# Altium schematic sheet GS_02_Core.SchDoc: Title
size A3; Date: Date; CompanyName: Integrated Micro-Electronics Bulgaria; Organization: Design & Development Department; Address1: Drawing Type; Address2: Address 1; Address3: Address 2; Address4: Address 3; DocumentNumber: 730xxx; Revision: 01; SheetNumber: 1; SheetTotal: 1; PageSetup: Record=PageOptions|CenterHorizontal=True|CenterVertical=True|PrintScale=0.70|XCorrection=1.00|YCorrection=1.00|PrintKind=2|BorderSize=5000000|LeftOffset=0|BottomOffset=0|Orientation=2|PaperLength=1000|PaperWidth=1000|Scale=100|PaperSource=7|PrintQuality=-4|MediaType=1|DitherType=10|PaperKind=A4|PrintScaleMode=1; SheetSize: A3; Time: Time; ModifiedDate: Mod. Date
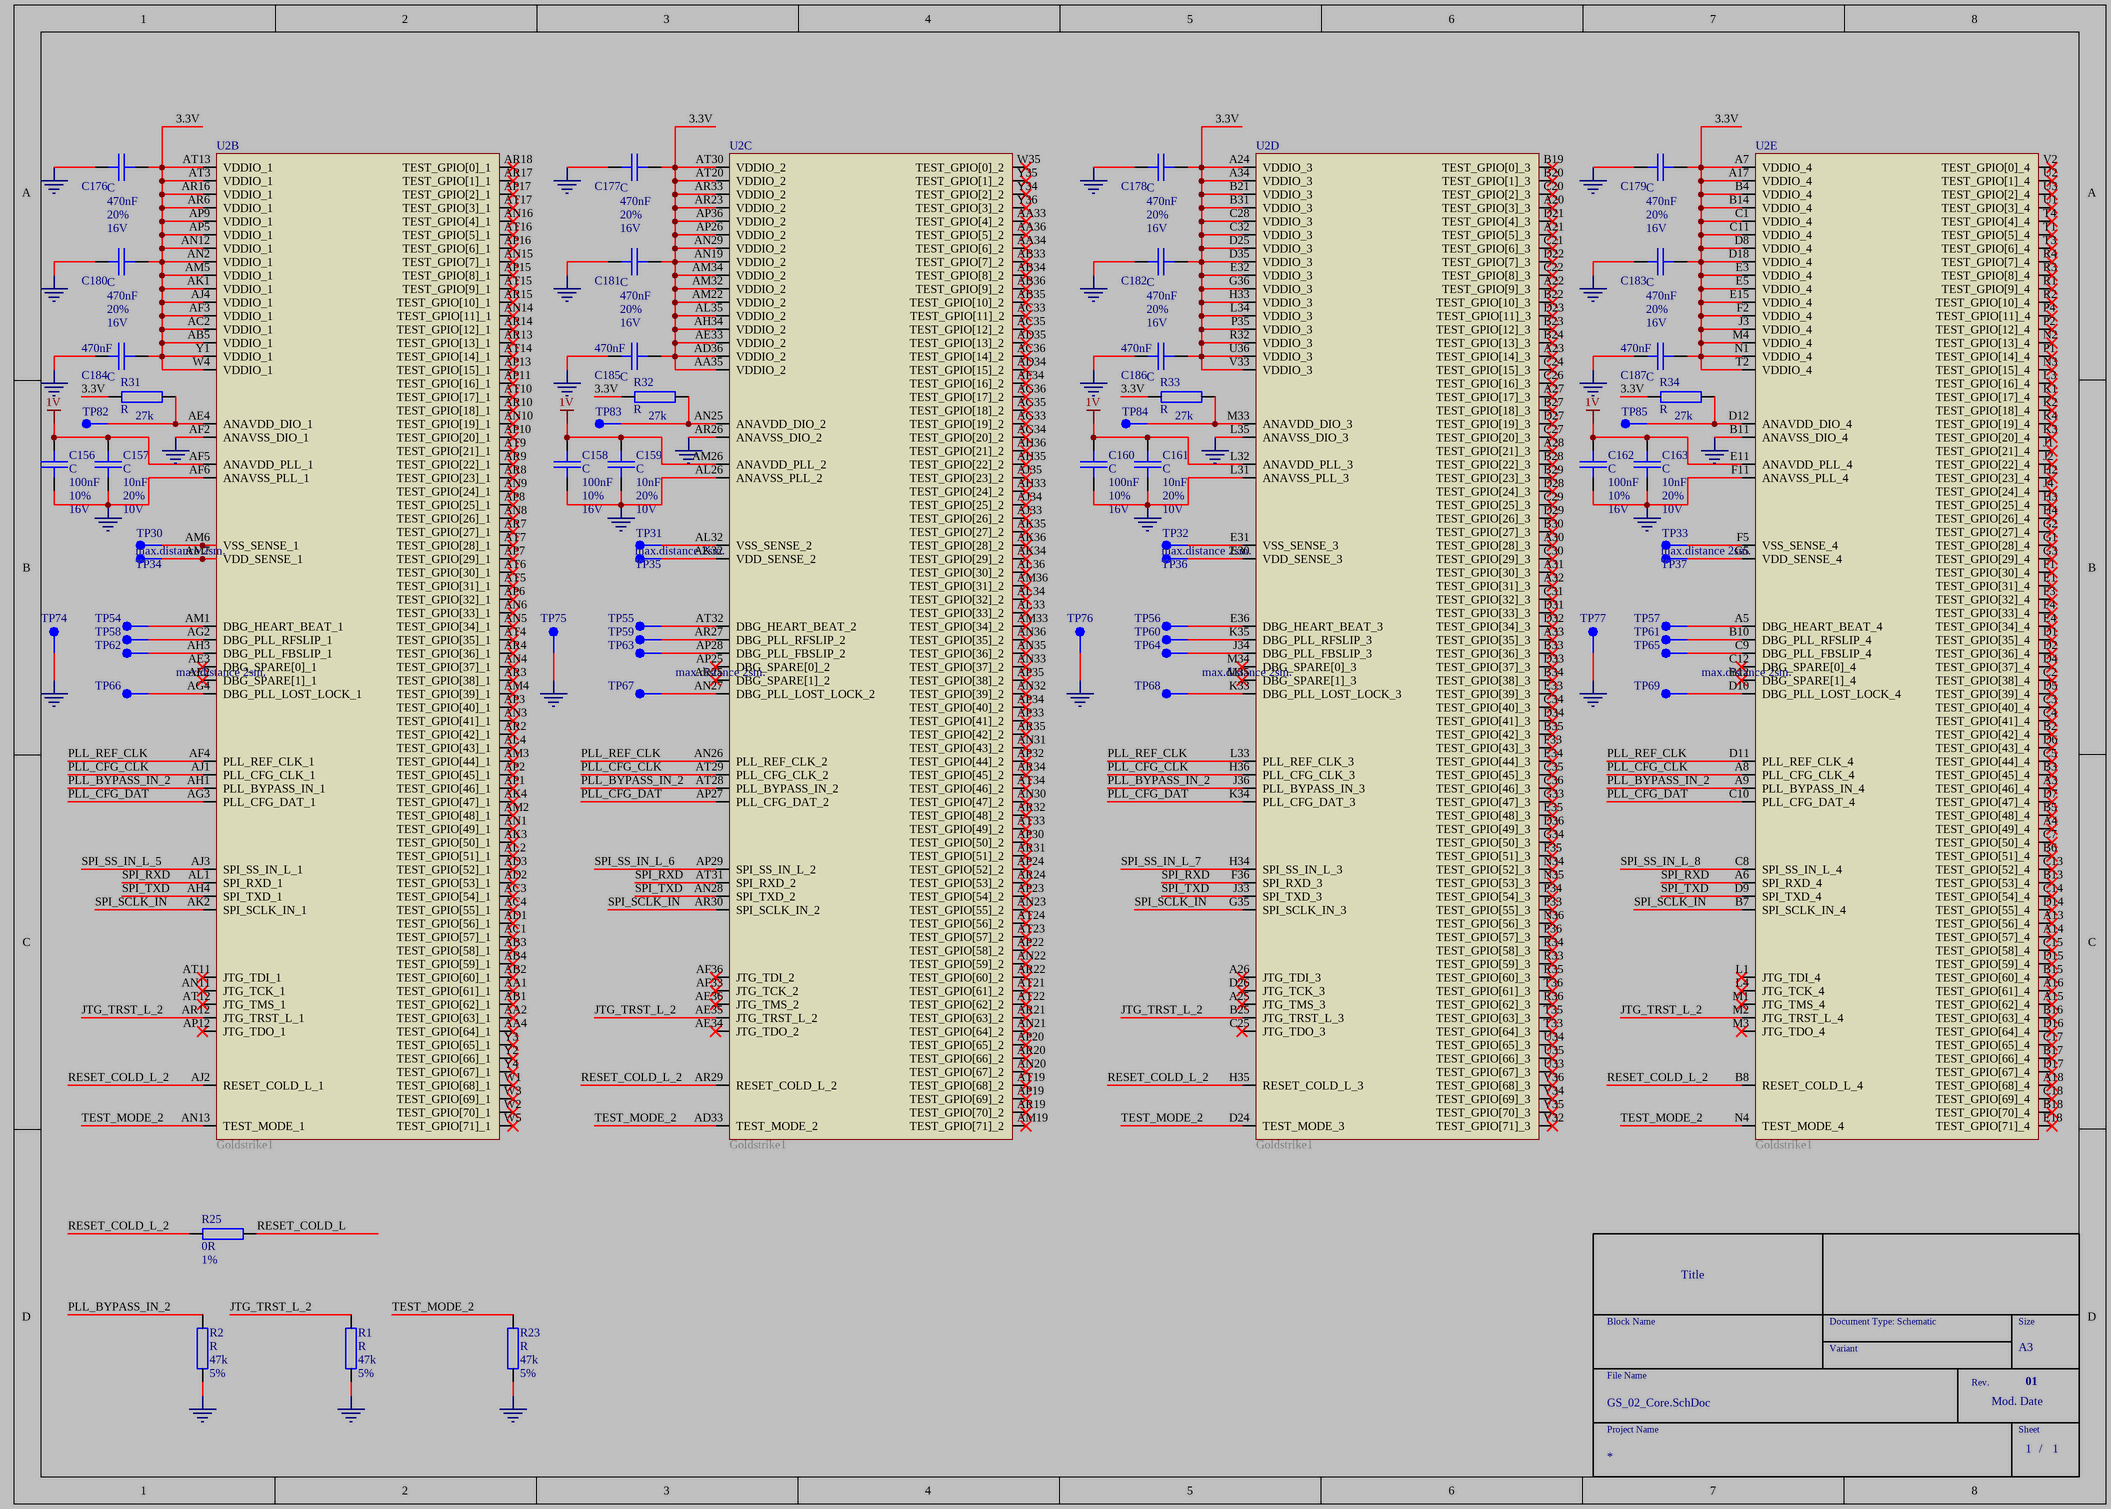
[diagram p0: GS_02_Core.SchDoc]

## Parts
C156  C  DB_VALUE: 100nF  DB_TOLERANCE: 10%  DB_VOLTAGE: 16V  [SMD_0603_CAPC1608X95N]
C157  C  DB_VALUE: 10nF  DB_TOLERANCE: 20%  DB_VOLTAGE: 10V  [SMD_0603_CAPC1608X95N]
C158  C  DB_VALUE: 100nF  DB_TOLERANCE: 10%  DB_VOLTAGE: 16V  [SMD_0603_CAPC1608X95N]
C159  C  DB_VALUE: 10nF  DB_TOLERANCE: 20%  DB_VOLTAGE: 10V  [SMD_0603_CAPC1608X95N]
C160  C  DB_VALUE: 100nF  DB_TOLERANCE: 10%  DB_VOLTAGE: 16V  [SMD_0603_CAPC1608X95N]
C161  C  DB_VALUE: 10nF  DB_TOLERANCE: 20%  DB_VOLTAGE: 10V  [SMD_0603_CAPC1608X95N]
C162  C  DB_VALUE: 100nF  DB_TOLERANCE: 10%  DB_VOLTAGE: 16V  [SMD_0603_CAPC1608X95N]
C163  C  DB_VALUE: 10nF  DB_TOLERANCE: 20%  DB_VOLTAGE: 10V  [SMD_0603_CAPC1608X95N]
C176  C  DB_VALUE: 470nF  DB_TOLERANCE: 20%  DB_VOLTAGE: 16V  [SMD_0603_CAPC1608X95N]
C177  C  DB_VALUE: 470nF  DB_TOLERANCE: 20%  DB_VOLTAGE: 16V  [SMD_0603_CAPC1608X95N]
C178  C  DB_VALUE: 470nF  DB_TOLERANCE: 20%  DB_VOLTAGE: 16V  [SMD_0603_CAPC1608X95N]
C179  C  DB_VALUE: 470nF  DB_TOLERANCE: 20%  DB_VOLTAGE: 16V  [SMD_0603_CAPC1608X95N]
C180  C  DB_VALUE: 470nF  DB_TOLERANCE: 20%  DB_VOLTAGE: 16V  [SMD_0603_CAPC1608X95N]
C181  C  DB_VALUE: 470nF  DB_TOLERANCE: 20%  DB_VOLTAGE: 16V  [SMD_0603_CAPC1608X95N]
C182  C  DB_VALUE: 470nF  DB_TOLERANCE: 20%  DB_VOLTAGE: 16V  [SMD_0603_CAPC1608X95N]
C183  C  DB_VALUE: 470nF  DB_TOLERANCE: 20%  DB_VOLTAGE: 16V  [SMD_0603_CAPC1608X95N]
C184  C  DB_VALUE: 470nF  [SMD_0603_CAPC1608X95N]
C185  C  DB_VALUE: 470nF  [SMD_0603_CAPC1608X95N]
C186  C  DB_VALUE: 470nF  [SMD_0603_CAPC1608X95N]
C187  C  DB_VALUE: 470nF  [SMD_0603_CAPC1608X95N]
R1  R  DB_VALUE: 47k  DB_TOLERANCE: 5%  [SMD_0603_RESC1608X55N]
R2  R  DB_VALUE: 47k  DB_TOLERANCE: 5%  [SMD_0603_RESC1608X55N]
R23  R  DB_VALUE: 47k  DB_TOLERANCE: 5%  [SMD_0603_RESC1608X55N]
R25  DB_VALUE: 0R  DB_TOLERANCE: 1%  [SMD_0603_RESC1608X55N]  (hidden comment: R)
R31  R  DB_VALUE: 27k  [SMD_0603_RESC1608X55N]
R32  R  DB_VALUE: 27k  [SMD_0603_RESC1608X55N]
R33  R  DB_VALUE: 27k  [SMD_0603_RESC1608X55N]
R34  R  DB_VALUE: 27k  [SMD_0603_RESC1608X55N]
TP30  TEST_POINT_1  [SMD_TP_100-254]  (value not drawn)
TP31  TEST_POINT_1  [SMD_TP_100-254]  (value not drawn)
TP32  TEST_POINT_1  [SMD_TP_100-254]  (value not drawn)
TP33  TEST_POINT_1  [SMD_TP_100-254]  (value not drawn)
TP34  TEST_POINT_1  [SMD_TP_100-254]  (value not drawn)
TP35  TEST_POINT_1  [SMD_TP_100-254]  (value not drawn)
TP36  TEST_POINT_1  [SMD_TP_100-254]  (value not drawn)
TP37  TEST_POINT_1  [SMD_TP_100-254]  (value not drawn)
TP54  TEST_POINT_1  [SMD_TP_100-254]  (value not drawn)
TP55  TEST_POINT_1  [SMD_TP_100-254]  (value not drawn)
TP56  TEST_POINT_1  [SMD_TP_100-254]  (value not drawn)
TP57  TEST_POINT_1  [SMD_TP_100-254]  (value not drawn)
TP58  TEST_POINT_1  [SMD_TP_100-254]  (value not drawn)
TP59  TEST_POINT_1  [SMD_TP_100-254]  (value not drawn)
TP60  TEST_POINT_1  [SMD_TP_100-254]  (value not drawn)
TP61  TEST_POINT_1  [SMD_TP_100-254]  (value not drawn)
TP62  TEST_POINT_1  [SMD_TP_100-254]  (value not drawn)
TP63  TEST_POINT_1  [SMD_TP_100-254]  (value not drawn)
TP64  TEST_POINT_1  [SMD_TP_100-254]  (value not drawn)
TP65  TEST_POINT_1  [SMD_TP_100-254]  (value not drawn)
TP66  TEST_POINT_1  [SMD_TP_100-254]  (value not drawn)
TP67  TEST_POINT_1  [SMD_TP_100-254]  (value not drawn)
TP68  TEST_POINT_1  [SMD_TP_100-254]  (value not drawn)
TP69  TEST_POINT_1  [SMD_TP_100-254]  (value not drawn)
TP74  TEST_POINT_1  [SMD_TP_100-254]  (value not drawn)
TP75  TEST_POINT_1  [SMD_TP_100-254]  (value not drawn)
TP76  TEST_POINT_1  [SMD_TP_100-254]  (value not drawn)
TP77  TEST_POINT_1  [SMD_TP_100-254]  (value not drawn)
TP82  TEST_POINT_1  [SMD_TP_100-254]  (value not drawn)
TP83  TEST_POINT_1  [SMD_TP_100-254]  (value not drawn)
TP84  TEST_POINT_1  [SMD_TP_100-254]  (value not drawn)
TP85  TEST_POINT_1  [SMD_TP_100-254]  (value not drawn)
U2  Goldstrike1  (parts B,C,D,E of 5)

## Nets
1V: C156.1 C157.1 C158.1 C159.1 C160.1 C161.1 C162.1 C163.1 U2.AF5(ANAVDD_PLL_1) U2.AM26(ANAVDD_PLL_2) U2.E11(ANAVDD_PLL_4) U2.L32(ANAVDD_PLL_3)
GND: C156.2 C157.2 C158.2 C159.2 C160.2 C161.2 C162.2 C163.2 C176.1 C177.1 C178.1 C179.1 C180.1 C181.1 C182.1 C183.1 C184.1 C185.1 C186.1 C187.1 R1.2 R2.2 R23.2 TP74.1 TP75.1 TP76.1 TP77.1 U2.AF2(ANAVSS_DIO_1) U2.AF6(ANAVSS_PLL_1) U2.AL26(ANAVSS_PLL_2) U2.AR26(ANAVSS_DIO_2) U2.B11(ANAVSS_DIO_4) U2.F11(ANAVSS_PLL_4) U2.L31(ANAVSS_PLL_3) U2.L35(ANAVSS_DIO_3)
3.3V: C176.2 C177.2 C178.2 C179.2 C180.2 C181.2 C182.2 C183.2 C184.2 C185.2 C186.2 C187.2 R31.1 R32.1 R33.1 R34.1 U2.A7(VDDIO_4) U2.A17(VDDIO_4) U2.A24(VDDIO_3) U2.A34(VDDIO_3) U2.AA35(VDDIO_2) U2.AB5(VDDIO_1) U2.AC2(VDDIO_1) U2.AD36(VDDIO_2) U2.AE33(VDDIO_2) U2.AF3(VDDIO_1) U2.AH34(VDDIO_2) U2.AJ4(VDDIO_1) U2.AK1(VDDIO_1) U2.AL35(VDDIO_2) U2.AM5(VDDIO_1) U2.AM22(VDDIO_2) U2.AM32(VDDIO_2) U2.AM34(VDDIO_2) U2.AN2(VDDIO_1) U2.AN12(VDDIO_1) U2.AN19(VDDIO_2) U2.AN29(VDDIO_2) U2.AP5(VDDIO_1) U2.AP9(VDDIO_1) U2.AP26(VDDIO_2) U2.AP36(VDDIO_2) U2.AR6(VDDIO_1) U2.AR16(VDDIO_1) U2.AR23(VDDIO_2) U2.AR33(VDDIO_2) U2.AT3(VDDIO_1) U2.AT13(VDDIO_1) U2.AT20(VDDIO_2) U2.AT30(VDDIO_2) U2.B4(VDDIO_4) U2.B14(VDDIO_4) U2.B21(VDDIO_3) U2.B31(VDDIO_3) U2.C1(VDDIO_4) U2.C11(VDDIO_4) U2.C28(VDDIO_3) U2.C32(VDDIO_3) U2.D8(VDDIO_4) U2.D18(VDDIO_4) U2.D25(VDDIO_3) U2.D35(VDDIO_3) U2.E3(VDDIO_4) U2.E5(VDDIO_4) U2.E15(VDDIO_4) U2.E32(VDDIO_3) U2.F2(VDDIO_4) U2.G36(VDDIO_3) U2.H33(VDDIO_3) U2.J3(VDDIO_4) U2.L34(VDDIO_3) U2.M4(VDDIO_4) U2.N1(VDDIO_4) U2.P35(VDDIO_3) U2.R32(VDDIO_3) U2.T2(VDDIO_4) U2.U36(VDDIO_3) U2.V33(VDDIO_3) U2.W4(VDDIO_1) U2.Y1(VDDIO_1)
JTG_TRST_L_2: R1.1 U2.AE35(JTG_TRST_L_2) U2.AR12(JTG_TRST_L_1) U2.B25(JTG_TRST_L_3) U2.M2(JTG_TRST_L_4)
PLL_BYPASS_IN_2: R2.1 U2.A9(PLL_BYPASS_IN_4) U2.AH1(PLL_BYPASS_IN_1) U2.AT28(PLL_BYPASS_IN_2) U2.J36(PLL_BYPASS_IN_3)
PLL_CFG_CLK: U2.A8(PLL_CFG_CLK_4) U2.AJ1(PLL_CFG_CLK_1) U2.AT29(PLL_CFG_CLK_2) U2.H36(PLL_CFG_CLK_3)
PLL_CFG_DAT: U2.AG3(PLL_CFG_DAT_1) U2.AP27(PLL_CFG_DAT_2) U2.C10(PLL_CFG_DAT_4) U2.K34(PLL_CFG_DAT_3)
PLL_REF_CLK: U2.AF4(PLL_REF_CLK_1) U2.AN26(PLL_REF_CLK_2) U2.D11(PLL_REF_CLK_4) U2.L33(PLL_REF_CLK_3)
RESET_COLD_L: R25.1
RESET_COLD_L_2: R25.2 U2.AJ2(RESET_COLD_L_1) U2.AR29(RESET_COLD_L_2) U2.B8(RESET_COLD_L_4) U2.H35(RESET_COLD_L_3)
SPI_RXD: U2.A6(SPI_RXD_4) U2.AL1(SPI_RXD_1) U2.AT31(SPI_RXD_2) U2.F36(SPI_RXD_3)
SPI_SCLK_IN: U2.AK2(SPI_SCLK_IN_1) U2.AR30(SPI_SCLK_IN_2) U2.B7(SPI_SCLK_IN_4) U2.G35(SPI_SCLK_IN_3)
SPI_SS_IN_L_5: U2.AJ3(SPI_SS_IN_L_1)
SPI_SS_IN_L_6: U2.AP29(SPI_SS_IN_L_2)
SPI_SS_IN_L_7: U2.H34(SPI_SS_IN_L_3)
SPI_SS_IN_L_8: U2.C8(SPI_SS_IN_L_4)
SPI_TXD: U2.AH4(SPI_TXD_1) U2.AN28(SPI_TXD_2) U2.D9(SPI_TXD_4) U2.J33(SPI_TXD_3)
TEST_MODE_2: R23.1 U2.AD33(TEST_MODE_2) U2.AN13(TEST_MODE_1) U2.D24(TEST_MODE_3) U2.N4(TEST_MODE_4)
NetR31_2: R31.2 TP82.1 U2.AE4(ANAVDD_DIO_1)
NetR32_2: R32.2 TP83.1 U2.AN25(ANAVDD_DIO_2)
NetR33_2: R33.2 TP84.1 U2.M33(ANAVDD_DIO_3)
NetR34_2: R34.2 TP85.1 U2.D12(ANAVDD_DIO_4)
NetTP30_1: TP30.1 U2.AM6(VSS_SENSE_1)
NetTP31_1: TP31.1 U2.AL32(VSS_SENSE_2)
NetTP32_1: TP32.1 U2.E31(VSS_SENSE_3)
NetTP33_1: TP33.1 U2.F5(VSS_SENSE_4)
NetTP34_1: TP34.1 U2.AM7(VDD_SENSE_1)
NetTP35_1: TP35.1 U2.AK32(VDD_SENSE_2)
NetTP36_1: TP36.1 U2.E30(VDD_SENSE_3)
NetTP37_1: TP37.1 U2.G5(VDD_SENSE_4)
NetTP54_1: TP54.1 U2.AM1(DBG_HEART_BEAT_1)
NetTP55_1: TP55.1 U2.AT32(DBG_HEART_BEAT_2)
NetTP56_1: TP56.1 U2.E36(DBG_HEART_BEAT_3)
NetTP57_1: TP57.1 U2.A5(DBG_HEART_BEAT_4)
NetTP58_1: TP58.1 U2.AG2(DBG_PLL_RFSLIP_1)
NetTP59_1: TP59.1 U2.AR27(DBG_PLL_RFSLIP_2)
NetTP60_1: TP60.1 U2.K35(DBG_PLL_RFSLIP_3)
NetTP61_1: TP61.1 U2.B10(DBG_PLL_RFSLIP_4)
NetTP62_1: TP62.1 U2.AH3(DBG_PLL_FBSLIP_1)
NetTP63_1: TP63.1 U2.AP28(DBG_PLL_FBSLIP_2)
NetTP64_1: TP64.1 U2.J34(DBG_PLL_FBSLIP_3)
NetTP65_1: TP65.1 U2.C9(DBG_PLL_FBSLIP_4)
NetTP66_1: TP66.1 U2.AG4(DBG_PLL_LOST_LOCK_1)
NetTP67_1: TP67.1 U2.AN27(DBG_PLL_LOST_LOCK_2)
NetTP68_1: TP68.1 U2.K33(DBG_PLL_LOST_LOCK_3)
NetTP69_1: TP69.1 U2.D10(DBG_PLL_LOST_LOCK_4)

Not connected (* = marked no-connect by the designer): U2 A3(TEST_GPIO[46]_4)* A4(TEST_GPIO[49]_4)* A13(TEST_GPIO[56]_4)* A14(TEST_GPIO[57]_4)* A15(TEST_GPIO[62]_4)* A16(TEST_GPIO[61]_4)* A18(TEST_GPIO[68]_4)* A20(TEST_GPIO[3]_3)* A21(TEST_GPIO[5]_3)* A22(TEST_GPIO[9]_3)* A23(TEST_GPIO[14]_3)* A25(JTG_TMS_3)* A26(JTG_TDI_3)* A27(TEST_GPIO[17]_3)* A28(TEST_GPIO[21]_3)* A30(TEST_GPIO[28]_3)* A31(TEST_GPIO[30]_3)* A32(TEST_GPIO[31]_3)* A33(TEST_GPIO[35]_3)* AA1(TEST_GPIO[61]_1)* AA2(TEST_GPIO[63]_1)* AA4(TEST_GPIO[64]_1)* AA33(TEST_GPIO[4]_2)* AA34(TEST_GPIO[6]_2)* AA36(TEST_GPIO[5]_2)* AB1(TEST_GPIO[62]_1)* AB2(TEST_GPIO[60]_1)* AB3(TEST_GPIO[58]_1)* AB4(TEST_GPIO[59]_1)* AB33(TEST_GPIO[7]_2)* AB34(TEST_GPIO[8]_2)* AB35(TEST_GPIO[10]_2)* AB36(TEST_GPIO[9]_2)* AC1(TEST_GPIO[57]_1)* AC3(TEST_GPIO[54]_1)* AC4(TEST_GPIO[55]_1)* AC33(TEST_GPIO[11]_2)* AC35(TEST_GPIO[12]_2)* AC36(TEST_GPIO[14]_2)* AD1(TEST_GPIO[56]_1)* AD2(TEST_GPIO[53]_1)* AD3(TEST_GPIO[52]_1)* AD34(TEST_GPIO[15]_2)* AD35(TEST_GPIO[13]_2)* AE2(DBG_SPARE[1]_1)* AE3(DBG_SPARE[0]_1)* AE34(JTG_TDO_2)* AE36(JTG_TMS_2)* AF33(JTG_TCK_2)* AF34(TEST_GPIO[16]_2)* AF36(JTG_TDI_2)* AG33(TEST_GPIO[19]_2)* AG34(TEST_GPIO[20]_2)* AG35(TEST_GPIO[18]_2)* AG36(TEST_GPIO[17]_2)* AH33(TEST_GPIO[24]_2)* AH35(TEST_GPIO[22]_2)* AH36(TEST_GPIO[21]_2)* AJ33(TEST_GPIO[26]_2)* AJ34(TEST_GPIO[25]_2)* AJ35(TEST_GPIO[23]_2)* AK3(TEST_GPIO[50]_1)* AK4(TEST_GPIO[47]_1)* AK34(TEST_GPIO[29]_2)* AK35(TEST_GPIO[27]_2)* AK36(TEST_GPIO[28]_2)* AL2(TEST_GPIO[51]_1)* AL4(TEST_GPIO[43]_1)* AL33(TEST_GPIO[33]_2)* AL34(TEST_GPIO[32]_2)* AL36(TEST_GPIO[30]_2)* AM2(TEST_GPIO[48]_1)* AM3(TEST_GPIO[44]_1)* AM4(TEST_GPIO[39]_1)* AM19(TEST_GPIO[71]_2)* AM33(TEST_GPIO[34]_2)* AM36(TEST_GPIO[31]_2)* AN1(TEST_GPIO[49]_1)* AN3(TEST_GPIO[41]_1)* AN4(TEST_GPIO[37]_1)* AN5(TEST_GPIO[34]_1)* AN6(TEST_GPIO[33]_1)* AN8(TEST_GPIO[26]_1)* AN9(TEST_GPIO[24]_1)* AN10(TEST_GPIO[19]_1)* AN11(JTG_TCK_1)* AN14(TEST_GPIO[11]_1)* AN15(TEST_GPIO[7]_1)* AN16(TEST_GPIO[4]_1)* AN20(TEST_GPIO[67]_2)* AN21(TEST_GPIO[64]_2)* AN22(TEST_GPIO[59]_2)* AN23(TEST_GPIO[55]_2)* AN30(TEST_GPIO[47]_2)* AN31(TEST_GPIO[43]_2)* AN32(TEST_GPIO[39]_2)* AN33(TEST_GPIO[37]_2)* AN35(TEST_GPIO[36]_2)* AN36(TEST_GPIO[35]_2)* AP1(TEST_GPIO[46]_1)* AP2(TEST_GPIO[45]_1)* AP3(TEST_GPIO[40]_1)* AP6(TEST_GPIO[32]_1)* AP7(TEST_GPIO[29]_1)* AP8(TEST_GPIO[25]_1)* AP10(TEST_GPIO[20]_1)* AP11(TEST_GPIO[16]_1)* AP12(JTG_TDO_1)* AP13(TEST_GPIO[15]_1)* AP15(TEST_GPIO[8]_1)* AP16(TEST_GPIO[6]_1)* AP17(TEST_GPIO[2]_1)* AP19(TEST_GPIO[69]_2)* AP20(TEST_GPIO[65]_2)* AP22(TEST_GPIO[58]_2)* AP23(TEST_GPIO[54]_2)* AP24(TEST_GPIO[52]_2)* AP25(DBG_SPARE[0]_2)* AP30(TEST_GPIO[50]_2)* AP32(TEST_GPIO[44]_2)* AP33(TEST_GPIO[41]_2)* AP34(TEST_GPIO[40]_2)* AP35(TEST_GPIO[38]_2)* AR2(TEST_GPIO[42]_1)* AR3(TEST_GPIO[38]_1)* AR4(TEST_GPIO[36]_1)* AR7(TEST_GPIO[27]_1)* AR8(TEST_GPIO[23]_1)* AR9(TEST_GPIO[22]_1)* AR10(TEST_GPIO[18]_1)* AR13(TEST_GPIO[13]_1)* AR14(TEST_GPIO[12]_1)* AR15(TEST_GPIO[10]_1)* AR17(TEST_GPIO[1]_1)* AR18(TEST_GPIO[0]_1)* AR19(TEST_GPIO[70]_2)* AR20(TEST_GPIO[66]_2)* AR21(TEST_GPIO[63]_2)* AR22(TEST_GPIO[60]_2)* AR24(TEST_GPIO[53]_2)* AR25(DBG_SPARE[1]_2)* AR31(TEST_GPIO[51]_2)* AR32(TEST_GPIO[48]_2)* AR34(TEST_GPIO[45]_2)* AR35(TEST_GPIO[42]_2)* AT4(TEST_GPIO[35]_1)* AT5(TEST_GPIO[31]_1)* AT6(TEST_GPIO[30]_1)* AT7(TEST_GPIO[28]_1)* AT9(TEST_GPIO[21]_1)* AT10(TEST_GPIO[17]_1)* AT11(JTG_TDI_1)* AT12(JTG_TMS_1)* AT14(TEST_GPIO[14]_1)* AT15(TEST_GPIO[9]_1)* AT16(TEST_GPIO[5]_1)* AT17(TEST_GPIO[3]_1)* AT19(TEST_GPIO[68]_2)* AT21(TEST_GPIO[61]_2)* AT22(TEST_GPIO[62]_2)* AT23(TEST_GPIO[57]_2)* AT24(TEST_GPIO[56]_2)* AT33(TEST_GPIO[49]_2)* AT34(TEST_GPIO[46]_2)* B2(TEST_GPIO[42]_4)* B3(TEST_GPIO[45]_4)* B5(TEST_GPIO[48]_4)* B6(TEST_GPIO[51]_4)* B12(DBG_SPARE[1]_4)* B13(TEST_GPIO[53]_4)* B15(TEST_GPIO[60]_4)* B16(TEST_GPIO[63]_4)* B17(TEST_GPIO[66]_4)* B18(TEST_GPIO[70]_4)* B19(TEST_GPIO[0]_3)* B20(TEST_GPIO[1]_3)* B22(TEST_GPIO[10]_3)* B23(TEST_GPIO[12]_3)* B24(TEST_GPIO[13]_3)* B27(TEST_GPIO[18]_3)* B28(TEST_GPIO[22]_3)* B29(TEST_GPIO[23]_3)* B30(TEST_GPIO[27]_3)* B33(TEST_GPIO[36]_3)* B34(TEST_GPIO[38]_3)* B35(TEST_GPIO[42]_3)* C2(TEST_GPIO[38]_4)* C3(TEST_GPIO[40]_4)* C4(TEST_GPIO[41]_4)* C5(TEST_GPIO[44]_4)* C7(TEST_GPIO[50]_4)* C12(DBG_SPARE[0]_4)* C13(TEST_GPIO[52]_4)* C14(TEST_GPIO[54]_4)* C15(TEST_GPIO[58]_4)* C17(TEST_GPIO[65]_4)* C18(TEST_GPIO[69]_4)* C20(TEST_GPIO[2]_3)* C21(TEST_GPIO[6]_3)* C22(TEST_GPIO[8]_3)* C24(TEST_GPIO[15]_3)* C25(JTG_TDO_3)* C26(TEST_GPIO[16]_3)* C27(TEST_GPIO[20]_3)* C29(TEST_GPIO[25]_3)* C30(TEST_GPIO[29]_3)* C31(TEST_GPIO[32]_3)* C34(TEST_GPIO[40]_3)* C35(TEST_GPIO[45]_3)* C36(TEST_GPIO[46]_3)* D1(TEST_GPIO[35]_4)* D2(TEST_GPIO[36]_4)* D4(TEST_GPIO[37]_4)* D5(TEST_GPIO[39]_4)* D6(TEST_GPIO[43]_4)* D7(TEST_GPIO[47]_4)* D14(TEST_GPIO[55]_4)* D15(TEST_GPIO[59]_4)* D16(TEST_GPIO[64]_4)* D17(TEST_GPIO[67]_4)* D21(TEST_GPIO[4]_3)* D22(TEST_GPIO[7]_3)* D23(TEST_GPIO[11]_3)* D26(JTG_TCK_3)* D27(TEST_GPIO[19]_3)* D28(TEST_GPIO[24]_3)* D29(TEST_GPIO[26]_3)* D31(TEST_GPIO[33]_3)* D32(TEST_GPIO[34]_3)* D33(TEST_GPIO[37]_3)* D34(TEST_GPIO[41]_3)* D36(TEST_GPIO[49]_3)* E1(TEST_GPIO[31]_4)* E4(TEST_GPIO[34]_4)* E18(TEST_GPIO[71]_4)* E33(TEST_GPIO[39]_3)* E34(TEST_GPIO[44]_3)* E35(TEST_GPIO[48]_3)* F1(TEST_GPIO[30]_4)* F3(TEST_GPIO[32]_4)* F4(TEST_GPIO[33]_4)* F33(TEST_GPIO[43]_3)* F35(TEST_GPIO[51]_3)* G1(TEST_GPIO[28]_4)* G2(TEST_GPIO[27]_4)* G3(TEST_GPIO[29]_4)* G33(TEST_GPIO[47]_3)* G34(TEST_GPIO[50]_3)* H2(TEST_GPIO[23]_4)* H3(TEST_GPIO[25]_4)* H4(TEST_GPIO[26]_4)* J1(TEST_GPIO[21]_4)* J2(TEST_GPIO[22]_4)* J4(TEST_GPIO[24]_4)* K1(TEST_GPIO[17]_4)* K2(TEST_GPIO[18]_4)* K3(TEST_GPIO[20]_4)* K4(TEST_GPIO[19]_4)* L1(JTG_TDI_4)* L3(TEST_GPIO[16]_4)* L4(JTG_TCK_4)* M1(JTG_TMS_4)* M3(JTG_TDO_4)* M34(DBG_SPARE[0]_3)* M35(DBG_SPARE[1]_3)* N2(TEST_GPIO[13]_4)* N3(TEST_GPIO[15]_4)* N34(TEST_GPIO[52]_3)* N35(TEST_GPIO[53]_3)* N36(TEST_GPIO[56]_3)* P1(TEST_GPIO[14]_4)* P2(TEST_GPIO[12]_4)* P4(TEST_GPIO[11]_4)* P33(TEST_GPIO[55]_3)* P34(TEST_GPIO[54]_3)* P36(TEST_GPIO[57]_3)* R1(TEST_GPIO[9]_4)* R2(TEST_GPIO[10]_4)* R3(TEST_GPIO[8]_4)* R4(TEST_GPIO[7]_4)* R33(TEST_GPIO[59]_3)* R34(TEST_GPIO[58]_3)* R35(TEST_GPIO[60]_3)* R36(TEST_GPIO[62]_3)* T1(TEST_GPIO[5]_4)* T3(TEST_GPIO[6]_4)* T4(TEST_GPIO[4]_4)* T33(TEST_GPIO[64]_3)* T35(TEST_GPIO[63]_3)* T36(TEST_GPIO[61]_3)* U1(TEST_GPIO[3]_4)* U2(TEST_GPIO[1]_4)* U3(TEST_GPIO[2]_4)* U33(TEST_GPIO[67]_3)* U34(TEST_GPIO[65]_3)* U35(TEST_GPIO[66]_3)* V2(TEST_GPIO[0]_4)* V32(TEST_GPIO[71]_3)* V34(TEST_GPIO[69]_3)* V35(TEST_GPIO[70]_3)* V36(TEST_GPIO[68]_3)* W1(TEST_GPIO[68]_1)* W2(TEST_GPIO[70]_1)* W3(TEST_GPIO[69]_1)* W5(TEST_GPIO[71]_1)* W35(TEST_GPIO[0]_2)* Y2(TEST_GPIO[66]_1)* Y3(TEST_GPIO[65]_1)* Y4(TEST_GPIO[67]_1)* Y34(TEST_GPIO[2]_2)* Y35(TEST_GPIO[1]_2)* Y36(TEST_GPIO[3]_2)*

## Notes on the sheet
- max.distance 2sm.
- Block Name
- Document Type: Schematic
- Size
- File Name
- Variant
- Rev.
- Project Name
- Sheet
- /

## Library data of the parts
C156 C158 C160 C162 = CAP000047357: NOTE: <NOTE>; DB_PART_NUMBER: CAP000047357
C157 C159 C161 C163 = CAP000038821: NOTE: <NOTE>; DB_PART_NUMBER: CAP000038821
C176-C183 = CAP000023179: DB_PART_TYPE: Ceramic_SMD\Open_Mode_X7R; DB_MANUFACTURER_PART: KEMET    C0603F474M4RAC; NOTE: <NOTE>; DB_T_RANGE: -55 to 125; DB_PACKAGE: 0603; DB_DESCRIPTION: C X7R 470nF 20% 16V 0603; DB_STATUS: NEW; DB_PART_NUMBER: CAP000023179; DB_PCB_DEVICE: SMD_0603_CAPC1608X95N; DB_APPROVED_ON: 09.10.2010; DB_DATASHEET: http://john.epiqdesign.com/projects/CIS_Datasheets/F3102_CE_Kemet.pdf?rev=92&sc=0
C184-C187 = CAP000023179: DB_PART_TYPE: Ceramic_SMD\Open_Mode_X7R; DB_MANUFACTURER_PART: KEMET    C0603F474M4RAC; NOTE: <NOTE>; DB_TOLERANCE: 20%; DB_VOLTAGE: 16V; DB_T_RANGE: -55 to 125; DB_PACKAGE: 0603; DB_DESCRIPTION: C X7R 470nF 20% 16V 0603; DB_STATUS: NEW; DB_PART_NUMBER: CAP000023179; DB_PCB_DEVICE: SMD_0603_CAPC1608X95N; DB_APPROVED_ON: 09.10.2010; DB_DATASHEET: http://john.epiqdesign.com/projects/CIS_Datasheets/F3102_CE_Kemet.pdf?rev=92&sc=0
R1 R2 R23 = RES000006462: DB_PART_TYPE: SMD; DB_MANUFACTURER_PART: YAGEO    RC0603JR-0747K; NOTE: <NOTE>; DB_T_RANGE: -55 to 155; DB_POWER: 1/10W; DB_PACKAGE: 0603; DB_DESCRIPTION: R SMD 47K 5% 1/10W 0603; DB_PRICE: 0.000364; DB_MOQ: 5000; DB_STATUS: NEW; R_BDS: R; DB_PART_NUMBER: RES000006462; DB_PCB_DEVICE: SMD_0603_RESC1608X55N; DB_PRICE_DATE: 2010-12-23; DB_APPROVED_ON: 09.10.2010; DB_DATASHEET: http://john.epiqdesign.com/projects/CIS_Datasheets/PYu-RC0603_51_RoHS_L_4_YAGEO.pdf?rev=138&sc=0
R25 = RES000008926: DB_PART_TYPE: SMD; DB_MANUFACTURER_PART: YAGEO    AC0603FR-070RL; NOTE: <NOTE>; DB_T_RANGE: -55 to 155; DB_POWER: 1/10W; DB_PACKAGE: 0603; DB_DESCRIPTION: R SMD 0R 1% 1/10W 0603; DB_CERTIFIED: AUT; DB_APPROVED_BY: VSN; DB_STATUS: NEW; R_BDS: R; DB_PART_NUMBER: RES000008926; DB_PCB_DEVICE: SMD_0603_RESC1608X55N; DB_APPROVED_ON: 21.05.2013 09:19:53; DB_DATASHEET: http://john.epiqdesign.com/projects/CIS_Datasheets/RES_AC_YAGEO.pdf?rev=263&sc=0
R31-R34 = RES000006456: DB_PART_TYPE: SMD; DB_MANUFACTURER_PART: YAGEO    RC0603JR-0727K; NOTE: <NOTE>; DB_TOLERANCE: 5%; DB_T_RANGE: -55 to 155; DB_POWER: 1/10W; DB_PACKAGE: 0603; DB_DESCRIPTION: R SMD 27K 5% 1/10W 0603; DB_PRICE: 0.000364; DB_MOQ: 5000; DB_STATUS: NEW; R_BDS: R; DB_PART_NUMBER: RES000006456; DB_PCB_DEVICE: SMD_0603_RESC1608X55N; DB_PRICE_DATE: 2010-12-23; DB_APPROVED_ON: 09.10.2010; DB_DATASHEET: http://john.epiqdesign.com/projects/CIS_Datasheets/PYu-RC0603_51_RoHS_L_4_YAGEO.pdf?rev=138&sc=0
TP30-TP37 TP54-TP69 TP74-TP77 TP82-TP85 = TPO000000001: DB_PART_TYPE: Test Point; DB_VALUE: 100_254; DB_DESCRIPTION: Test Point 100_254; DB_STATUS: NEW; DB_PART_NUMBER: TPO000000001; DB_DIAMETER: 100_254; DB_PCB_DEVICE: SMD_TP_100-254; DB_APPROVED_ON: 10.09.2010